# EAGLE design CHECON.PCB (EAGLE 7.5.0)
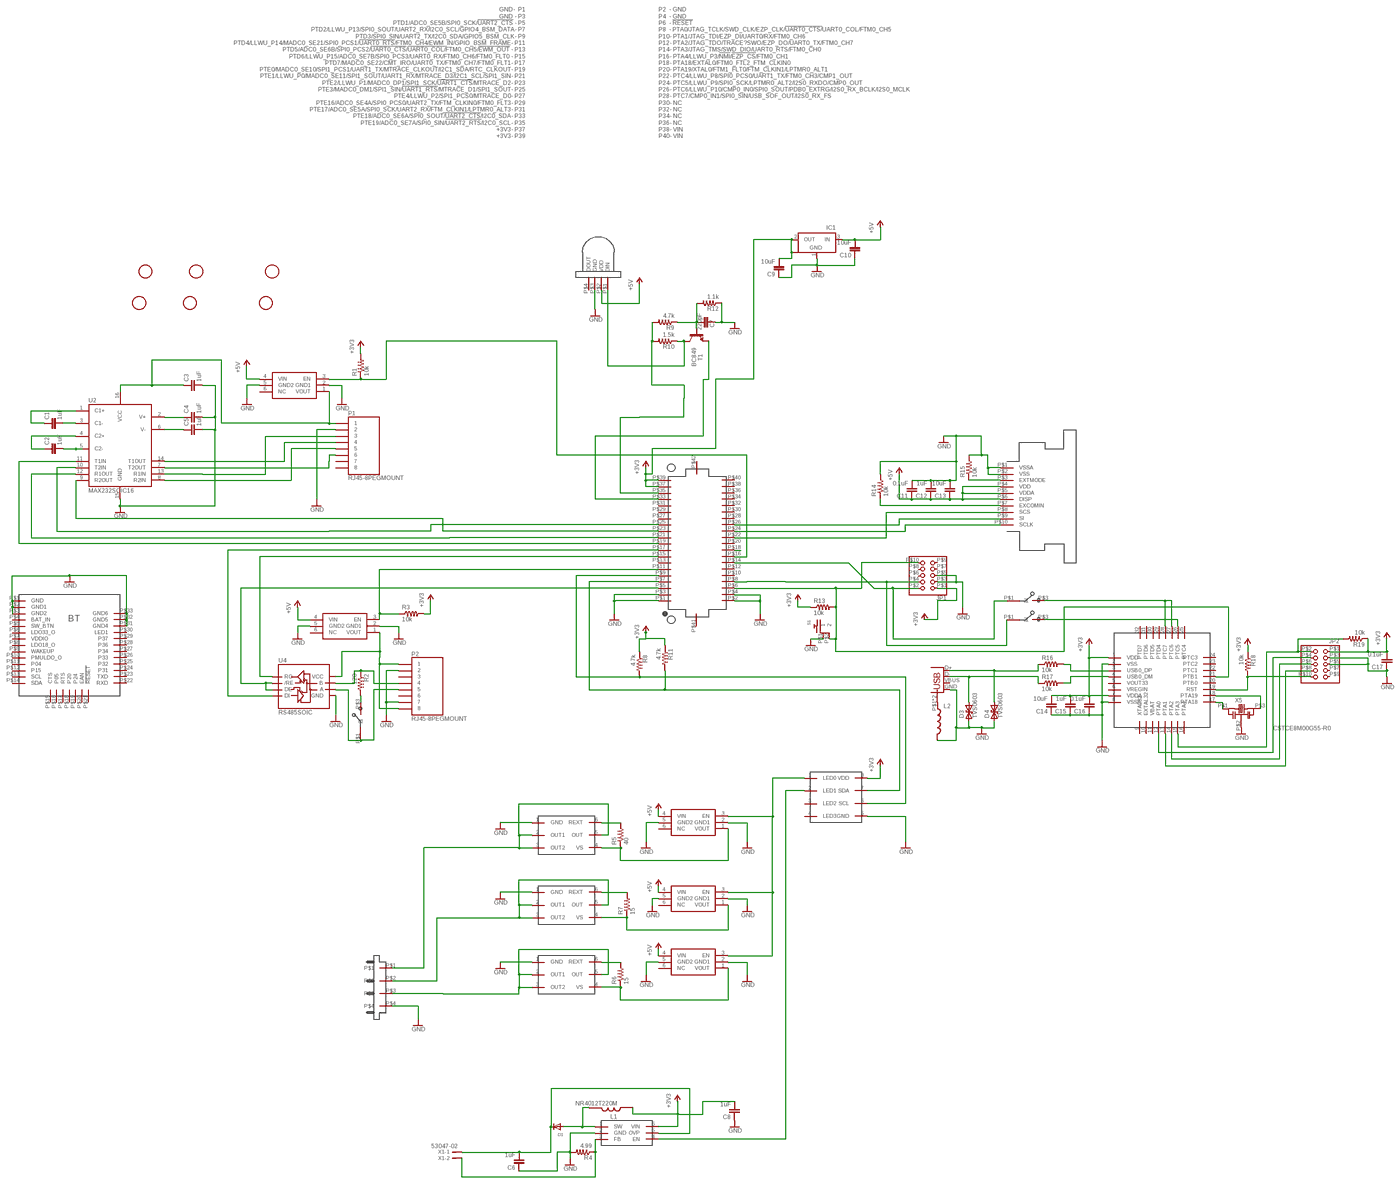
[diagram p0: schematic, sheet 1, overview]
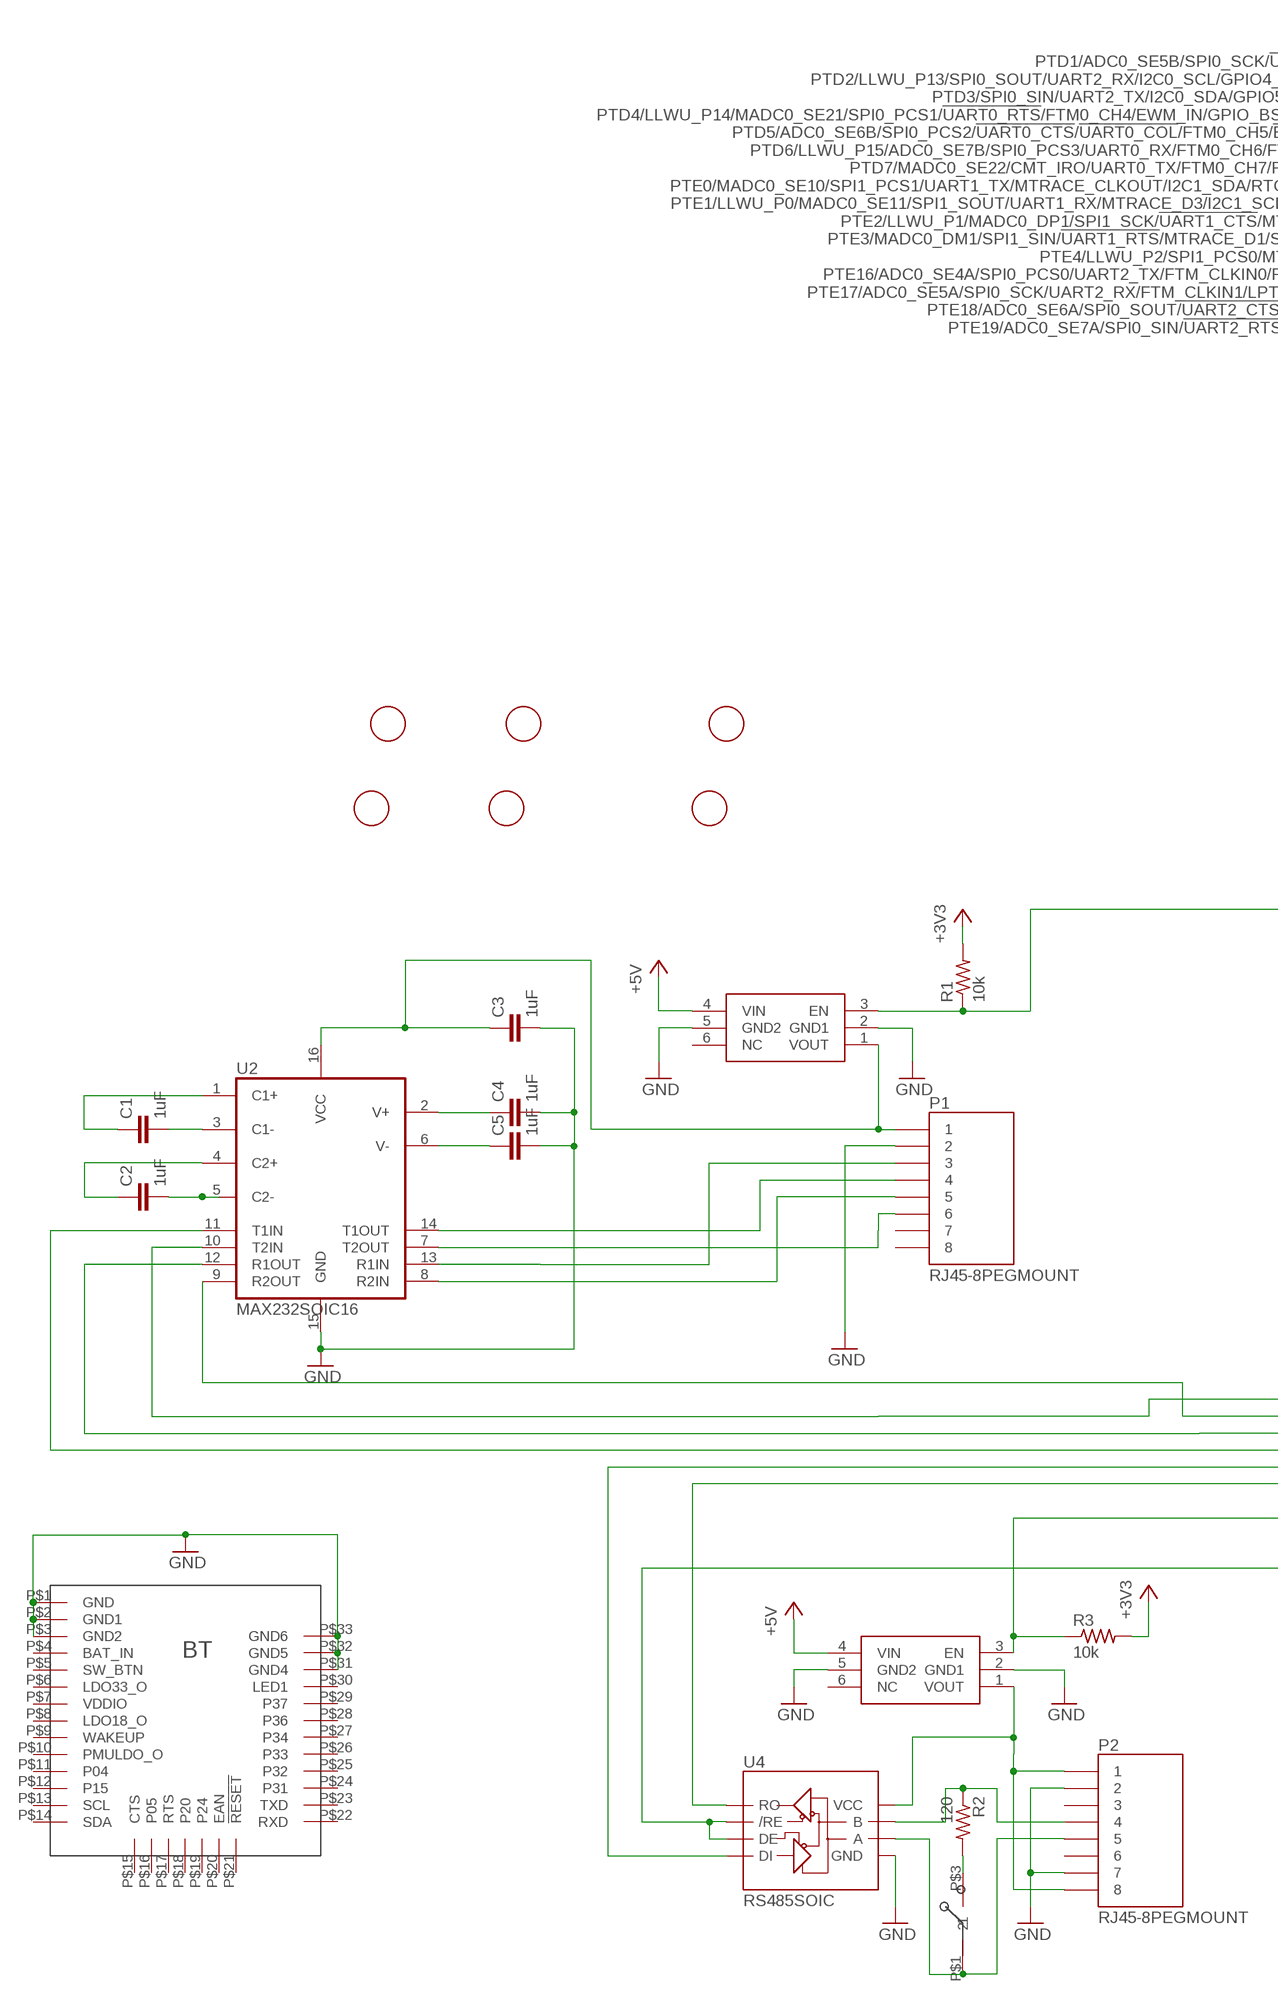
[diagram p1: schematic, sheet 1, part 1 of 4]
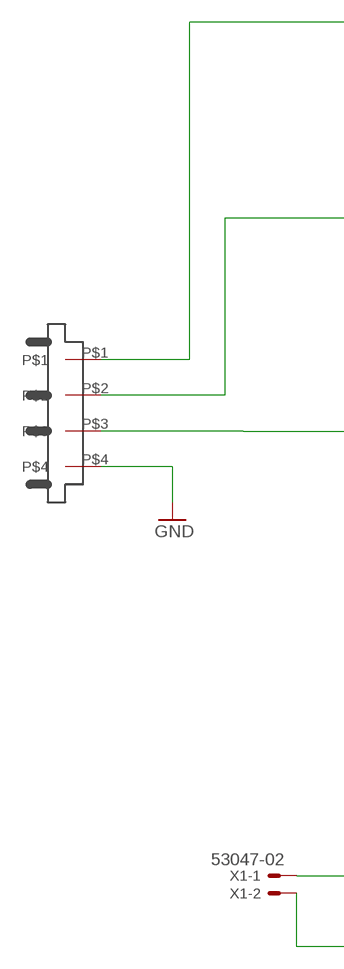
[diagram p2: schematic, sheet 1, part 2 of 4]
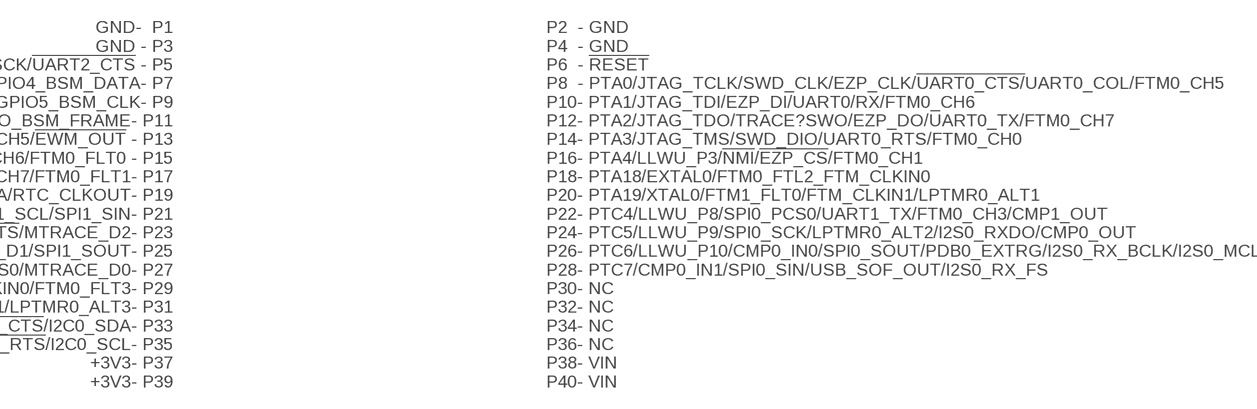
[diagram p3: schematic, sheet 1, part 3 of 4]
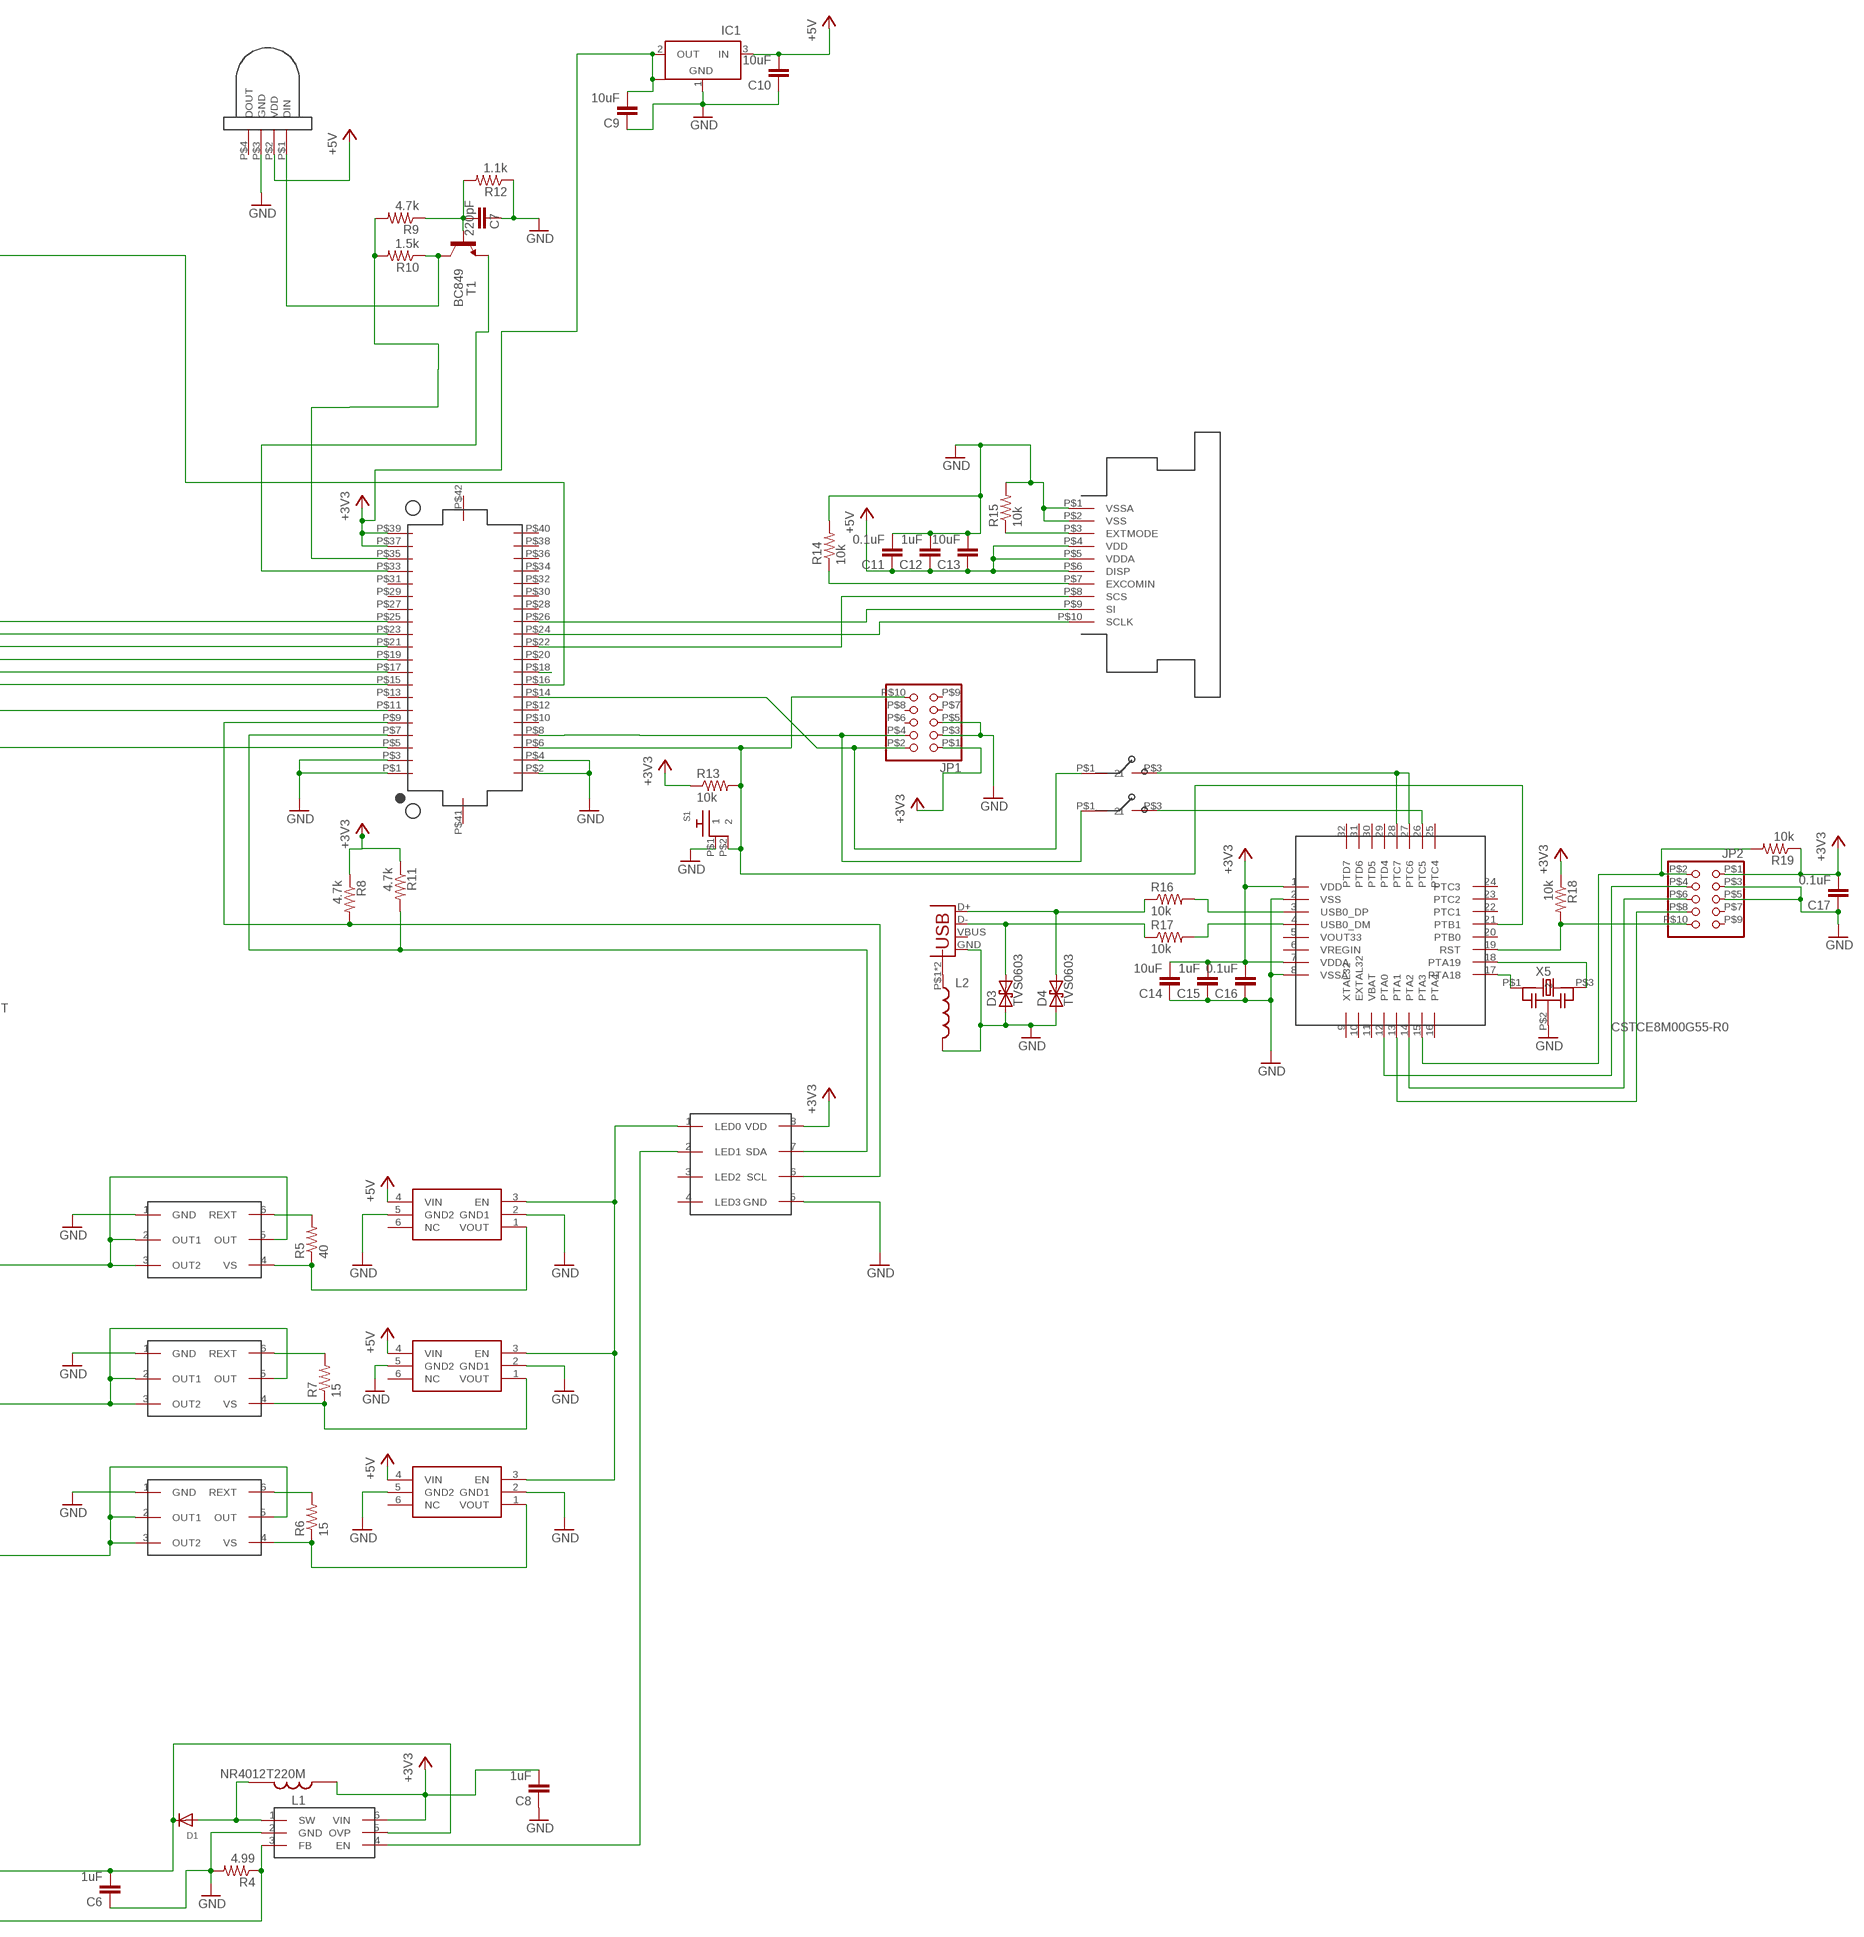
[diagram p4: schematic, sheet 1, part 4 of 4]

## Parts
C1  1uF  RF-C0805  [C0805]
C2  1uF  RF-C0805  [C0805]
C3  1uF  RF-C0805  [C0805]
C4  1uF  RF-C0805  [C0805]
C5  1uF  RF-C0805  [C0805]
C6  1uF  RF-C0805  [C0805]
C7  220pF  RF-C0805  [C0805]
C8  1uF  RF-C0805  [C0805]
C9  10uF  RF-C0805  [C0805]
C10  10uF  RF-C0805  [C0805]
C11  0.1uF  RF-C0805  [C0805]
C12  1uF  RF-C0805  [C0805]
C13  10uF  RF-C0805  [C0805]
C14  10uF  RF-C0805  [C0805]
C15  1uF  RF-C0805  [C0805]
C16  0.1uF  RF-C0805  [C0805]
C17  0.1uF  RF-C0805  [C0805]
D1  DIODESOD-523  [SOD-523]
D2  LED_PTH_2812  [LED_PTH_2812]
D3  TVS0603  [0603-RES]
D4  TVS0603  [0603-RES]
F1  FIDUCIAL  [FIDUCIAL_1MM]
F2  FIDUCIAL  [FIDUCIAL_1MM]
F3  FIDUCIAL  [FIDUCIAL_1MM]
F4  FIDUCIAL  [FIDUCIAL_1MM]
F5  FIDUCIAL  [FIDUCIAL_1MM]
F6  FIDUCIAL  [FIDUCIAL_1MM]
IC1  NCP1117ST33T3G_1  [SOT223]
J1  2.7_BL_CONN  [XD2B-0406-26A]
J2  USB_B  [USB-B-PTH-VERTICAL]
J3  52745-1097  [52745-1097]
JP1  PINHD-2X5SMALL  [2X5HDR]
JP2  PINHD-2X5SMALL  [2X5HDR]
L1  NR4012T220M  [NR4012T220M]
L2  INDUCTOR0603  [0603]
P1  RJ45-8PEGMOUNT  [MOLEX-0955016889]
P2  RJ45-8PEGMOUNT  [MOLEX-0955016889]
R1  10k  RF-R0805  [RF-C0805]
R2  120  RF-R0805  [RF-C0805]
R3  10k  RF-R0805  [RF-C0805]
R4  4.99  RF-R0805  [RF-C0805]
R5  40  RF-R0805  [RF-C0805]
R6  15  RF-R0805  [RF-C0805]
R7  15  RF-R0805  [RF-C0805]
R8  4.7k  RF-R0805  [RF-C0805]
R9  4.7k  RF-R0805  [RF-C0805]
R10  1.5k  RF-R0805  [RF-C0805]
R11  4.7k  RF-R0805  [RF-C0805]
R12  1.1k  RF-R0805  [RF-C0805]
R13  10k  RF-R0805  [RF-C0805]
R14  10k  RF-R0805  [RF-C0805]
R15  10k  RF-R0805  [RF-C0805]
R16  10k  RF-R0805  [RF-C0805]
R17  10k  RF-R0805  [RF-C0805]
R18  10k  RF-R0805  [RF-C0805]
R19  10k  RF-R0805  [RF-C0805]
S1  RA_BUTTON  [RA_BUTTON]
SW1  CJS  [CJS]
SW2  CJS  [CJS]
SW3  CJS  [CJS]
T1  BC849  [SOT23]
U1  BM78  [BM78]
U2  MAX232SOIC16  [SO016]
U3  MIC94061C6  [SC70-6L]
U4  RS485SOIC  [SO08]
U5  MIC94061C6  [SC70-6L]
U6  AP5724  [SOT23-6]
U7  MIC94061C6  [SC70-6L]
U8  MIC94061C6  [SC70-6L]
U9  MIC94061C6  [SC70-6L]
U10  KW2_CPU_OFFSET  [BRAIN_OFFSET]
U11  PCA9632DP1  [TSSOP-8]
U12  KL20  [QFN-32-NOPAD]
X1  53047-02  [53047-02]
X2  BCR401U  [SOT23-6]
X3  BCR401U  [SOT23-6]
X4  BCR401U  [SOT23-6]
X5  CSTCE8M00G55-R0  [CSTCE_G_A]

## Nets
+3V3: C8.2 C9.2 C14.2 C15.2 C16.2 C17.2 IC1.2(OUT) IC1.4(OUT1) JP1.P$1 JP2.P$1 L1.P$2 R1.2 R3.2 R8.1 R11.1 R13.1 R18.1 R19.1 U6.6(VIN) U10.P$37(+3V3) U10.P$39(+3V3) U11.8(VDD) U12.1(VDD) U12.7(VDDA)
+5V: C10.2 D2.P$2(VDD) IC1.3(IN) U7.4(VIN) U8.4(VIN) U9.4(VIN)
C1: C1.1 U2.1(C1+)
C2: C2.1 U2.4(C2+)
GND [GND]: C3.2 C4.2 C5.2 C6.1 C7.1 C8.1 C9.1 C10.1 C11.2 C12.2 C13.2 C14.1 C15.1 C16.1 C17.1 D2.P$3(GND) D3.1 D4.1 IC1.1(GND) J1.P$4 J2.GND J3.P$1(VSSA) J3.P$2(VSS) JP1.P$3 JP1.P$5 JP2.P$3 JP2.P$5 L2.2 P1.P$2 P2.P$2 P2.P$7 R4.2 R12.1 R14.2 R15.2 S1.P$1 U1.P$1(GND) U1.P$2(GND1) U1.P$3(GND2) U1.P$31(GND4) U1.P$32(GND5) U1.P$33(GND6) U2.15(GND) U3.2(GND1) U3.5(GND2) U4.5(GND) U5.2(GND1) U5.5(GND2) U6.2(GND) U7.2(GND1) U7.5(GND2) U8.2(GND1) U8.5(GND2) U9.2(GND1) U9.5(GND2) U10.P$1(GND) U10.P$2(GND) U10.P$3(GND) U10.P$4(GND) U11.5(GND) U12.2(VSS) U12.8(VSSA) X2.1(GND) X3.1(GND) X4.1(GND) X5.P$2
N$1: SW2.P$3 U12.27(PTC6) U12.28(PTC7)
N$2: U6.4(EN) U11.2(LED1)
N$3: R4.1 U6.3(FB) X1.2
N$4: U12.17(PTA18) X5.P$1
N$5: J2.P$1(SHIELD) J2.P$2(SHIELD) L2.1
N$6: U12.18(PTA19) X5.P$3
N$7: P1.P$6 U2.7(T2OUT)
N$9: J1.P$1 X2.2(OUT1) X2.3(OUT2) X2.5(OUT)
N$10: U2.12(R1OUT) U10.P$21(PTE1/LLWU_P0/MADC0_SE11/SPI1_SOUT/UART1_RX/MTRACE_D3/I2C1_SCL/SPI1_SIN)
N$11: R9.2 R10.2 U10.P$35(PTE19/ADC0_SE7A/SPI0_SIN/!UART2_RTS!/I2C0_SCL)
N$12 [GND]: P1.P$4 U2.14(T1OUT)
N$13: R6.1 U9.1(VOUT) X4.4(VS)
N$14: R7.1 U8.1(VOUT) X3.4(VS)
N$15: R5.1 U7.1(VOUT) X2.4(VS)
N$16: T1.2(E) U10.P$33(PTE18/ADC0_SE6A/SPI0_SOUT/!UART2_CTS!/I2C0_SDA)
N$17 [GND]: U4.1(RO) U10.P$15(PTD6/LLWU_P15/ADC0_SE7B/SPI0_PCS3/UART0_RX/FTM0_CH6/FTM0_FLT0)
N$18: C1.2 U2.3(C1-)
N$19: P2.P$4 R2.1 U4.7(B)
N$20: P2.P$5 SW1.P$1 U4.6(A)
N$21: C2.2 U2.5(C2-)
N$22: C5.1 U2.6(V-)
N$23: C4.1 U2.2(V+)
N$24: R16.2 U12.3(USB0_DP)
N$25: C3.1 P1.P$1 U2.16(VCC) U3.1(VOUT)
N$26: U2.11(T1IN) U10.P$19(PTE0/MADC0_SE10/SPI1_PCS1/UART1_TX/MTRACE_CLKOUT/I2C1_SDA/RTC_CLKOUT)
N$27 [GND]: U4.4(DI) U10.P$17(PTD7/MADC0_SE22/CMT_IRO/UART0_TX/FTM0_CH7/FTM0_FLT1)
N$28 [GND]: U4.2(/RE) U4.3(DE) U10.P$5(PTD1/ADC0_SE5B/SPI0_SCK/!UART2_CTS)
N$29 [GND]: J3.P$9(SI) U10.P$26(PTC6/LLWU_P10/CMP0_IN0/SPI0_SOUT/PDB0_EXTRG/I2S0_RX_BCLK/I2S0_MCLK)
N$30 [GND]: J3.P$10(SCLK) U10.P$24(PTC5/LLWU_P8/SPI0_PCS0/UART1_TX/FTM0_CH3/CMP1_OUT)
N$31 [GND]: J3.P$8(SCS) U10.P$22(PTC4/LLWU_P8/SPI0_PCS0/UART1_TX/FTM0_CH3/CMP1_OUT)
N$32 [GND]: J3.P$3(EXTMODE) R15.1
N$33 [GND]: J3.P$7(EXCOMIN) R14.1
N$34: P1.P$5 U2.8(R2IN)
N$35: D3.2 J2.D- R17.1
N$36: D4.2 J2.D+ R16.1
N$37: R6.2 X4.6(REXT)
N$38: U2.9(R2OUT) U10.P$23(PTE2/LLWU_P1/MADC0_DP1/SPI1_SCK/!UART1_CTS!/MTRACE_D2)
N$39: R3.1 U5.3(EN) U10.P$11(PTD4/LLWU_P14/MADC0_SE21/SPI0_PCS1/!UART0_RTS!/FTM0_CH4/EWM_IN/GPIO_BSM_FRAME)
N$40: R1.1 U3.3(EN) U10.P$16(PTA4/LLWU_P3/!NMI!/!EZP_CS!/FTM0_CH1)
N$41: U2.10(T2IN) U10.P$25(PTE3/MADC0_DM1/SPI1_SIN/!UART1_RTS!/MTRACE_D1/SPI1_SOUT)
N$42: R7.2 X3.6(REXT)
N$43: R5.2 X2.6(REXT)
N$44: U7.3(EN) U8.3(EN) U9.3(EN) U11.1(LED0)
N$45: R11.2 U10.P$7(PTD2/LLWU_P13/SPI0_SOUT/UART2_RX/I2C0_SCL/GPIO4_BSM_DATA) U11.7(SDA)
N$46: U10.P$18(PTA18/EXTAL0/FTM0_FTL2_FTM_CLKIN0)
N$47: R8.2 U10.P$9(PTD3/SPI0_SIN/UART2_TX/I2C0_SDA/GPIO5_BSM_CLK) U11.6(SCL)
N$48: D2.P$1(DIN) R10.1 T1.3(C)
N$49: C7.2 R9.1 R12.2 T1.1(B)
N$50: D1.A L1.P$1 U6.1(SW)
N$51: J1.P$3 X4.2(OUT1) X4.3(OUT2) X4.5(OUT)
N$52: JP2.P$2 R19.2 U12.15(PTA3)
N$53: J1.P$2 X3.2(OUT1) X3.3(OUT2) X3.5(OUT)
N$54: C6.2 D1.K(C) U6.5(OVP) X1.1
N$55: JP2.P$4 U12.12(PTA0)
N$56: JP2.P$6 U12.14(PTA2)
N$57: JP2.P$8 U12.13(PTA1)
N$58: JP2.P$10 R18.2 U12.19(RST)
N$59: R2.2 SW1.P$3
N$60: R17.2 U12.4(USB0_DM)
R1IN: P1.P$3 U2.13(R1IN)
RST: JP1.P$10 R13.2 S1.P$2 U10.P$6(!RESET) U12.21(PTB1)
SWD_CLK: JP1.P$4 SW3.P$1 U10.P$8(PTA0/JTAG_TCLK/SWD_CLK/EZP_CLK/!UART0_CTS/!UART0_COL/FTM0_CH5)
SWD_DIO: JP1.P$2 SW2.P$1 U10.P$14(PTA3/JTAG_TMS/SWD_DIO/UART0_RTS/FTM0_CH0)
SWD_TGT_CLK: SW3.P$3 U12.26(PTC5)
V+: C11.1 C12.1 C13.1 J3.P$4(VDD) J3.P$5(VDDA) J3.P$6(DISP) P2.P$1 P2.P$8 U3.4(VIN) U4.8(VCC) U5.1(VOUT) U5.4(VIN) ; supply symbol labelled +5V
Unconnected: D2.P$4(DOUT) J2.VBUS JP1.P$6 JP1.P$7 JP1.P$8 JP1.P$9 JP2.P$7 JP2.P$9 P1.P$7 P1.P$8 P2.P$3 P2.P$6 U1.P$4(BAT_IN) U1.P$5(SW_BTN) U1.P$6(LDO33_O) U1.P$7(VDDIO) U1.P$8(LDO18_O) U1.P$9(WAKEUP) U1.P$10(PMULDO_O) U1.P$11(P04) U1.P$12(P15) U1.P$13(SCL) U1.P$14(SDA) U1.P$15(CTS) U1.P$16(P05) U1.P$17(RTS) U1.P$18(P20) U1.P$19(P24) U1.P$20(EAN) U1.P$21(!RESET) U1.P$22(RXD) U1.P$23(TXD) U1.P$24(P31) U1.P$25(P32) U1.P$26(P33) U1.P$27(P34) U1.P$28(P36) U1.P$29(P37) U1.P$30(LED1) U3.6(NC) U5.6(NC) U7.6(NC) U8.6(NC) U9.6(NC) U10.P$10(PTA1/JTAG_TDI/EZP_DI/UART0/RX/FTM0_CH6) U10.P$12(PTA2/JTAG_TDO/TRACE?SWO/EZP_DO/UART0_TX/FTM0_CH7) U10.P$13(PTD5/ADC0_SE6B/SPI0_PCS2/!UART0_CTS!/!UART0_COL!/FTM0_CH5/!EWM_OUT) U10.P$20(PTA19/XTAL0/FTM1_FLT0/FTM_CLKIN1/LPTMR0_ALT1) U10.P$27(PTE4/LLWU_P2/SPI1_PCS0/MTRACE_D0) U10.P$28(PTC7/CMP0_IN1/SPI0_SIN/USB_SOF_OUT/I2S0_RX_FS) U10.P$29(PTE16/ADC0_SE4A/SPI0_PCS0/UART2_TX/FTM_CLKIN0/FTM0_FLT3) U10.P$30(NC) U10.P$31(PTE17/ADC0_SE5A/SPI0_SCK/UART2_RX/FTM_CLKIN1/LPTMR0_ALT3) U10.P$32(NC) U10.P$34(NC) U10.P$36(NC) U10.P$38(VIN) U10.P$40(VIN) U10.P$41 U10.P$42 U11.3(LED2) U11.4(LED3) U12.5(VOUT33) U12.6(VREGIN) U12.9(XTAL32) U12.10(EXTAL32) U12.11(VBAT) U12.16(PTA4) U12.20(PTB0) U12.22(PTC1) U12.23(PTC2) U12.24(PTC3) U12.25(PTC4) U12.29(PTD4) U12.30(PTD5) U12.31(PTD6) U12.32(PTD7)

## Library data of the parts
C1-C6 C8 C12 C15 = GW-devices:RF-C: RF capacitor pads for FSL reference design; MFGN: TDK; MFGP: C2012X5R1E105K125AA
C7 C11 C16 C17 = GW-devices:RF-C: RF capacitor pads for FSL reference design; MFGN: TDK; MFGP: C2012X5R1H104K085AA
C9 C10 C13 C14 = GW-devices:RF-C: RF capacitor pads for FSL reference design; MFGN: Murata; MFGP: GRM219R61E106KA12D
D1 = adafruit:DIODE: Diode SMADIODE - SMA Surface Mount Package 20V 1A Schottky Diode Digikey: 641-1014-6-ND DO-1N4148 - Through Hole Small Current Diode SOD-123 20V 1 A (.5mV Vf) Schottky Diode - Digikey: MBRX120TPMSCT-ND SOD-323 10V 570mA (.38mV Vf, 3ns) Schottky Diode - Digikey: ZLLS410CT-ND SOD-523 30V 30mA Schottky Diode (RB751S-40TE61) - Digikey: RB751S-40TE61CT-ND SOT23-R/W - SOT23 Package (R = Solder Paste/Reflow Ovens, W = Hand-Soldering) BAT54Film 40V 300mA - Digikey: 497-7162-1-ND; MFGN: Diodes, Inc.; MFGP: SDM20U40-7
D2 = KW2:LED_PTH_2812; MFGN: Sparkfun; MFGP: COM-12999
D3 D4 = SparkFun:TVS; MFGN: Eaton Bussman; MFGP: 0603ESDA2-TR2
F1-F6 = adafruit:FIDUCIAL: For use by pick and place machines to calibrate the vision/machine, 1mm By microbuilder.eu; NOTES: DNP
IC1 = KW2:NCP1117ST33T3G_1: VOLTAGE REGULATOR; MFGN: OnSemi; MFGP: NCP1117ST33T3G
J1 = KW2:2.7_BL_CONN; MFGN: Omron Electronics; MFGP: XD2B-0406-26A
J2 = KW2:USB_B; MFGN: Harwin; MFGP: M701-330442
J3 = KW2:52745-1097
JP1 JP2 = KW2:PINHD-2X5: PIN HEADER; MFGN: Sullins Connector Solutions; MFGP: GRPB052VWVN-RC
L1 = KW2:NR4012T220M; MFGN: Taiyo Yuden; MFGP: NR4012T220M
L2 = SparkFun:INDUCTOR: Inductors Basic Inductor/Choke - 0603 and 1206. Footprints are not proven and vary greatly between part numbers.; MFGN: TDK; MFGP: MPZ1608S331ATA00
P1 P2 = GW-devices:RJ45-8: RJ45 Jack MFG part number 54602-908lf
R1-R3 R8 R11 = GW-devices:RF-R: RF resistor pads for FSL reference design; MFGN: Panasonic; MFGP: ERJ-6ENF4701V
R4 = GW-devices:RF-R: RF resistor pads for FSL reference design; MFGN: Stackpole Electronics Inc.; MFGP: RMCF0805FT4R99
R5 = GW-devices:RF-R: RF resistor pads for FSL reference design; MFGN: Yageo; MFGP: RC0805FR-0740R2L
R6 R7 = GW-devices:RF-R: RF resistor pads for FSL reference design; MFGN: Yageo; MFGP: RC0805FR-0715RL
R9 R10 R12-R19 = GW-devices:RF-R: RF resistor pads for FSL reference design; MFGN: Vishay Dale; MFGP: CRCW080510K0FKEA
S1 = KW2:RA_BUTTON
SW1-SW3 = KW2:CJS; MFGN: Copal Electronics Inc; MFGP: CJS-1200TA
T1 = transistor:BC849: NPN TRANSISTOR
U1 = KW2:BM78
U2 = SparkFun:MAX232: RS232 Transceiver Very common IC. This is generically called 'MAX232', but works with the 3V equivalent MAX3232 generic ICs. Field tested and mother approved. Spark Fun Electronics SKU : COM-00316 (DIP) and COM-00589 (SMD); PRICE: 0.86
U3 U5 U7-U9 = GW-devices:MIC94061; MFGN: Micrel; MFGP: MIC94061YC6 TR; PRICE: 1.50
U4 = SparkFun:RS485; PRICE: 4.29
U6 = KW2:AP5724; MFGN: Diodes, Inc; MFGP: AP5724
U10 = KW2:KW2_CPU
U11 = KW2:PCA9632DP1; MFGN: NXP; MFGP: PCA9632DP1
U12 = KW2:KL20; MFGN: Freescale; MFGP: MK20DX128VFM5
X1 = con-molex:53?-02: CONNECTOR wire to board 1.25 mm (.049 inch) pitch header; MF: MOLEX; MPN: 53047-0210; OC_FARNELL: 9733051; OC_NEWARK: 57H4701
X2-X4 = KW2:BCR401U; MFGN: Infineon; MFGP: BCR401U
X5 = KW2:CSTCE8M00G55-R0

## Board
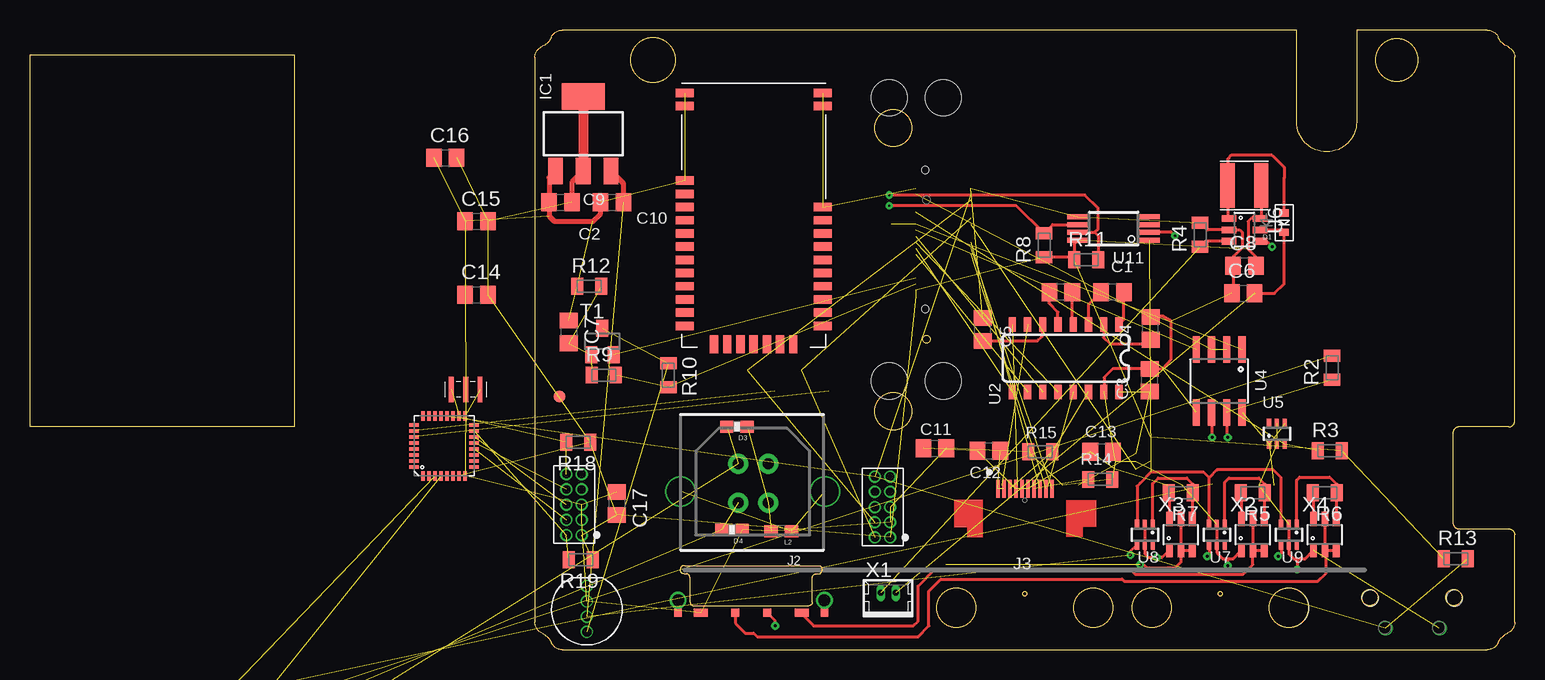
[diagram p5: board, top side]
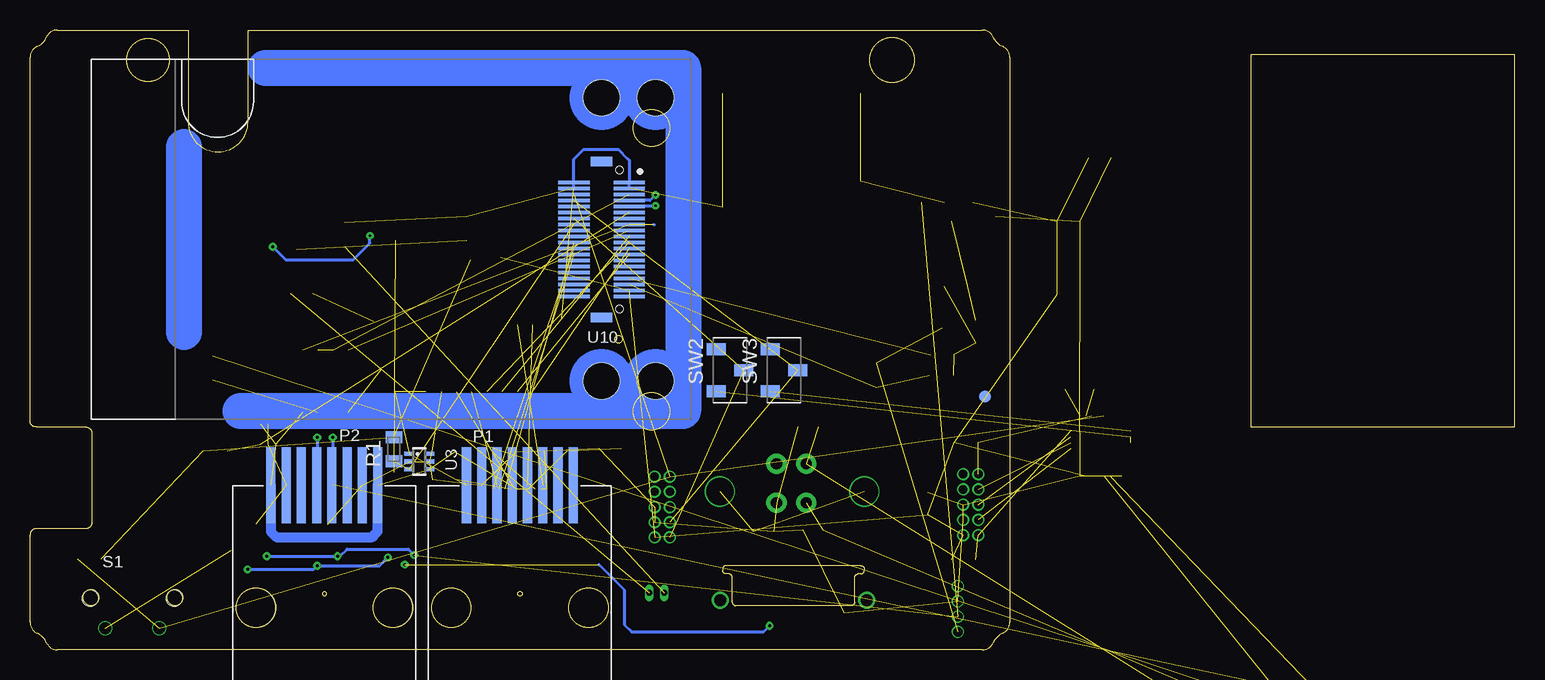
[diagram p6: board, bottom side, seen from below]

Size 123.73 x 51.65 mm. Coordinates in mm from the lower left corner, seen from the top.
Outline: 60 segments
Outline: circle at 51.9,49.16 radius 1.85
Outline: circle at 71.93,43.48 radius 1.52
Outline: circle at 113.9,49.16 radius 1.75
Outline: circle at 118.65,4.36 radius 0.65
Outline: circle at 111.64,4.36 radius 0.65
Outline: circle at 104.9,3.5 radius 1.62
Outline: circle at 93.47,3.5 radius 1.62
Outline: circle at 88.62,3.5 radius 1.62
Outline: circle at 77.19,3.5 radius 1.62
Outline: circle at 71.93,19.88 radius 1.52
Outline: circle at 74.7,25.88 radius 0.3
Outline: circle at 71.93,43.48 radius 1.52
Outline: circle at 71.93,19.88 radius 1.52
Outline: circle at 74.7,25.88 radius 0.3
Outline: circle at 113.9,49.16 radius 1.75
Outline: circle at 51.9,49.16 radius 1.85
Outline: circle at 82.9,4.67 radius 0.17
Outline: circle at 99.19,4.67 radius 0.14
Outline: circle at 104.9,3.5 radius 1.62
Outline: circle at 93.47,3.5 radius 1.62
Copper layers (1*16): Top 0.035559375mm / dielectric 1.47mm / Bottom 0.035559375mm
Design rules "Codeshelf_Advanced *": minimum track width 0.2mm, minimum drill 0.25mm, track to track 0.2mm, track to pad 0.2mm, pad to pad 0.2mm, via to via 0.2mm, smd to smd 0mil, copper to edge 0.2mm, drill to drill 0.2mm, minimum pad ring 0.1mm, minimum via ring 0.2mm, stop-mask expansion 0.05mm, vias tented up to drill 0.5mm, thermal gap 0.25mm
Holes 2.5 mm at 50.6,57

### Footprints (pad centres in the part's own frame; a part is rotated, then mirrored left to right if it is on the bottom)
C0805 = smd 1.3 x 1.5: 1 -0.95,0; 2 0.95,0
SOD-523 = smd 0.8 x 0.6: A 0,-0.8; K 0,0.8
LED_PTH_2812 = drill 0.8 pad 1.016: P$1 0,-1.905; P$2 0,-0.635; P$3 0,0.635; P$4 0,1.905
0603-RES = smd 1.1 x 1: 1 -0.85,0; 2 0.85,0
FIDUCIAL_1MM = smd 1 x 1: 1 0,0
SOT223 = smd 1.219 x 2.235: 1 -2.311,-3.099; 2 0,-3.099; 3 2.311,-3.099 | smd 3.6 x 2.2: 4 0,3.099
XD2B-0406-26A = smd 1.15 x 0.65: P$1 4.2,0; P$4 -4.2,0 | smd 0.65 x 0.65: P$2 1.325,0; P$3 -1.325,0; P$7 -6.1,0; P$8 6.1,0 | drill 1 pad 1.4: P$5 -6.1,1.025; P$6 6.1,1.025
USB-B-PTH-VERTICAL = drill 0.92 pad 1.676: D+ 4.826,3.95; D- 4.826,7.2; GND 7.315,3.95; VBUS 7.315,7.2 | drill 2.3: P$1 0,4.9; P$2 12.04,4.9
52745-1097 = smd 0.3 x 1.5: P$1 -2.25,0.95; P$2 -1.75,0.95; P$3 -1.25,0.95; P$4 -0.75,0.95; P$5 -0.25,0.95; P$6 0.25,0.95; P$7 0.75,0.95; P$8 1.25,0.95; P$9 1.75,0.95; P$10 2.25,0.95
2X5HDR = drill 0.7 pad 1: P$1 -2.54,-0.67; P$2 -2.54,0.6; P$3 -1.27,-0.67; P$4 -1.27,0.6; P$5 0,-0.67; P$6 0,0.6; P$7 1.27,-0.67; P$8 1.27,0.6; P$9 2.54,-0.67; P$10 2.54,0.6
NR4012T220M = smd 1.2 x 3.7: P$1 1.4,0; P$2 -1.4,0
0603 = smd 1.1 x 1: 1 -0.85,0; 2 0.85,0
MOLEX-0955016889 = smd 0.76 x 6.35: P$1 -4.45,10.225; P$2 -3.18,10.225; P$3 -1.91,10.225; P$4 -0.64,10.225; P$5 0.63,10.225; P$6 1.905,10.225; P$7 3.175,10.225; P$8 4.445,10.225 | hole 3.25: -5.715,0; 5.715,0
RF-C0805 = smd 1 x 1.4: 1 -1,0; 2 1,0
RA_BUTTON = drill 0.99: P$1 -2.25,0; P$2 2.25,0 | hole 1.3: -3.501,2.49; 3.501,2.49
CJS = smd 1 x 1.6: P$1 0,1.15; P$2 -1.75,-1.15; P$3 1.75,-1.15
SOT23 = smd 1 x 1.4: 1 -0.95,-1.1; 2 0.95,-1.1; 3 0,1.1
BM78 = smd 1.5 x 0.7: P$1 -5.75,21.2; P$2 -5.75,20.1; P$3 -5.75,13.9; P$4 -5.75,12.8; P$5 -5.75,11.7; P$6 -5.75,10.6; P$7 -5.75,9.5; P$8 -5.75,8.4; P$9 -5.75,7.3; P$10 -5.75,6.2; P$11 -5.75,5.1; P$12 -5.75,4; P$13 -5.75,2.9; P$14 -5.75,1.8; P$22 5.75,1.8; P$23 5.75,2.9; P$24 5.75,4; P$25 5.75,5.1; P$26 5.75,6.2; P$27 5.75,7.3; P$28 5.75,8.4; P$29 5.75,9.5; P$30 5.75,10.6; P$31 5.75,11.7; P$32 5.75,20.1; P$33 5.75,21.2 | smd 0.7 x 1.5: P$15 -3.3,0.25; P$16 -2.2,0.25; P$17 -1.1,0.25; P$18 0,0.25; P$19 1.1,0.25; P$20 2.2,0.25; P$21 3.3,0.25
SO016 = smd 0.6 x 1.2: 1 -4.445,-2.8; 2 -3.175,-2.8; 3 -1.905,-2.8; 4 -0.635,-2.8; 5 0.635,-2.8; 6 1.905,-2.8; 7 3.175,-2.8; 8 4.445,-2.8; 9 4.445,2.8; 10 3.175,2.8; 11 1.905,2.8; 12 0.635,2.8; 13 -0.635,2.8; 14 -1.905,2.8; 15 -3.175,2.8; 16 -4.445,2.8
SC70-6L = smd 0.35 x 0.8: 1 -0.65,-0.85; 2 0,-0.85; 3 0.65,-0.85; 4 0.65,0.85; 5 0,0.85; 6 -0.65,0.85
SO08 = smd 0.61 x 2.21: 1 -1.905,-2.616; 2 -0.635,-2.616; 3 0.635,-2.616; 4 1.905,-2.616; 5 1.905,2.616; 6 0.635,2.616; 7 -0.635,2.616; 8 -1.905,2.616
SOT23-6 = smd 0.55 x 1.2: 1 -0.95,-1.3; 2 0,-1.3; 3 0.95,-1.3; 4 0.95,1.3; 5 0,1.3; 6 -0.95,1.3
BRAIN_OFFSET = smd 0.3 x 2.6: P$1 -4.75,2.3; P$2 -4.75,-2.3; P$3 -4.25,2.3; P$4 -4.25,-2.3; P$5 -3.75,2.3; P$6 -3.75,-2.3; P$7 -3.25,2.3; P$8 -3.25,-2.3; P$9 -2.75,2.3; P$10 -2.75,-2.3; P$11 -2.25,2.3; P$12 -2.25,-2.3; P$13 -1.75,2.3; P$14 -1.75,-2.3; P$15 -1.25,2.3; P$16 -1.25,-2.3; P$17 -0.75,2.3; P$18 -0.75,-2.3; P$19 -0.25,2.3; P$20 -0.25,-2.3; P$21 0.25,2.3; P$22 0.25,-2.3; P$23 0.75,2.3; P$24 0.75,-2.3; P$25 1.25,2.3; P$26 1.25,-2.3; P$27 1.75,2.3; P$28 1.75,-2.3; P$29 2.25,2.3; P$30 2.25,-2.3; P$31 2.75,2.3; P$32 2.75,-2.3; P$33 3.25,2.3; P$34 3.25,-2.3; P$35 3.75,2.3; P$36 3.75,-2.3; P$37 4.25,2.3; P$38 4.25,-2.3; P$39 4.75,2.3; P$40 4.75,-2.3 | smd 0.8 x 1.8: P$41 -6.5,0; P$42 6.5,0 | hole 0.6: -5.8,1.5; 5.8,1.5 | hole 3: -11.8,4.5; 11.8,4.5; -11.8,0; 11.8,0
TSSOP-8 = smd 0.42 x 1.78: 1 -0.975,-2.975; 2 -0.325,-2.975; 3 0.325,-2.975; 4 0.975,-2.975; 5 0.975,2.975; 6 0.325,2.975; 7 -0.325,2.975; 8 -0.975,2.975
QFN-32-NOPAD = smd 0.8 x 0.285: 1 -2.5,1.75; 2 -2.5,1.25; 3 -2.5,0.75; 4 -2.5,0.25; 5 -2.5,-0.25; 6 -2.5,-0.75; 7 -2.5,-1.25; 8 -2.5,-1.75; 17 2.5,-1.75; 18 2.5,-1.25; 19 2.5,-0.75; 20 2.5,-0.25; 21 2.5,0.25; 22 2.5,0.75; 23 2.5,1.25; 24 2.5,1.75 | smd 0.285 x 0.8: 9 -1.75,-2.5; 10 -1.25,-2.5; 11 -0.75,-2.5; 12 -0.25,-2.5; 13 0.25,-2.5; 14 0.75,-2.5; 15 1.25,-2.5; 16 1.75,-2.5; 25 1.75,2.5; 26 1.25,2.5; 27 0.75,2.5; 28 0.25,2.5; 29 -0.25,2.5; 30 -0.75,2.5; 31 -1.25,2.5; 32 -1.75,2.5
53047-02 = drill 0.5 pad 0.698 long: 1 0.625,0.45; 2 -0.625,0.45
CSTCE_G_A = smd 0.4 x 2.1: P$1 -1.2,0; P$2 0,0; P$3 1.2,0

### Placement (x,y rotation side)
C1  90.2,29.8 180 top
C2  85.9,29.8 180 top
C3  93.33,22.47 90 top
C4  93.38,26.79 90 top
C5  79.4,26.7 90 top
C6  101.1,29.7 0 top
C7  44.9,26.5 270 top
C8  101.2,32 0 top
C9  44.2,37.3 0 top
C10  48.5,37.3 0 top
C11  75.4,16.8 0 top
C12  79.9,16.6 0 top
C13  89.3,16.5 0 top
C14  37.2,29.6 0 top
C15  37.2,35.7 0 top
C16  34.6,41 0 top
C17  48.9,12.2 270 top
D1  104.5,35.6 180 top
D2  46.4,3.4 0 top
D3  58.9,18.6 180 top
D4  58.5,10 180 top
F1  120.54,67.22 0 bottom  (outside the outline)
F2  44.14,21.11 0 top
F3  44.14,21.11 0 bottom
F4  44.6,67.65 0 top  (outside the outline)
F5  44.6,67.65 0 bottom  (outside the outline)
F6  120.54,67.22 0 top  (outside the outline)
IC1  46.1,43 0 top
J1  60.1,3.1 0 top
J2  54.2,8.3 0 top
J3  82.9,12.47 0 top
JP1  71,11.9 90 top
JP2  45.3,12.1 90 top
L1  101.2,38.7 180 top
L2  62.6,9.9 180 top
P1  82.9,3.5 0 bottom
P2  99.2,3.5 0 bottom
R1  93.4,16.7 90 bottom
R2  108.5,23.5 90 top
R3  108.3,16.6 0 top
R4  97.5,34.6 90 top
R5  101.9,13.1 180 top
R6  107.9,13.1 180 top
R7  95.9,13.1 180 top
R8  84.5,33.7 90 top
R9  47.8,22.9 0 top
R10  53.2,22.9 270 top
R11  88,32.5 0 top
R12  46.6,30.3 0 top
R13  118.8,7.6 0 top
R14  89.2,14.2 0 top
R15  84.2,16.5 180 top
R16  7.8,-11.5 0 top  (outside the outline)
R17  7.8,-17.1 0 top  (outside the outline)
R18  45.7,17.3 180 top
R19  45.9,7.5 180 top
S1  115.2,1.8 0 bottom
SW1  8.6,-6.6 0 top  (outside the outline)
SW2  65.4,23.3 270 bottom
SW3  60.9,23.3 270 bottom
T1  47.7,25.7 0 top
U1  60.3,25.2 0 top
U2  86.3,24.3 180 top
U3  91.29,15.69 270 bottom
U4  99.1,22.4 180 top
U5  103.9,18 0 top
U6  101.2,35 270 top
U7  98.9,9.6 180 top
U8  92.9,9.6 180 top
U9  104.9,9.6 180 top
U10  76.1,34.2 270 bottom
U11  90.3,35.1 90 top
U12  34.5,17 90 top
X1  71.5,4.3 0 top
X2  101.9,9.6 0 top
X3  95.9,9.6 0 top
X4  107.9,9.6 0 top
X5  36.3,21.7 180 top

### Tracks (layer width: path | path; a pad name or v marks a point on that pad's centre or on a via)
+3V3  (17 unrouted)
  Top 0.254: L1.P$2 102.6,36.05 U6.6 101.75,35.95 101.5,35.7 101.5,33.4 102.1,32.8 102.1,32.05 C8.2 | U11.8 87,33.8 R11.1 86.8,32.7 R8.1
  Top 0.406: IC1.2 45.15,38.95 C9.2
  Top 0.813: IC1.4 IC1.2
+5V  (via drill 0.25)  (2 unrouted)
  Top 0.254: U7.4 98.25,7.95 v98.1,7.8 | v91.7,7.9 91.7,8.2 U8.4 | U9.4 104.25,8.05 v104,7.8
  Top 0.406: IC1.3 49.45,38.86 C10.2
  Bottom 0.254: 91.8,7.8 v91.7,7.9 92.2,8.4 97.3,8.4 97.9,7.8 v98.1,7.8 v104,7.8
C1
  Top 0.254: U2.1 91.15,27.5 C1.1
C2
  Top 0.254: U2.4 86.85,27.18 C2.1
GND  (via drill 0.25)  (47 unrouted)
  Top 0.254: R4.2 98.1,35 U6.2 100.8,35 101,34.8 101,33.5 100.3,32.8 100.3,32.05 C8.1 100.25,29.8 C6.1 | U8.2 U8.5 92.9,8 93.2,7.7 v93.9,7.7 | U7.2 U7.5 98.9,8.1 99.4,7.6 99.9,7.6 | U9.2 U9.5 104.9,8 105.3,7.6 105.6,7.6 | v93.9,7.7 94.35,7.7 | 94.35,7.7 X3.1 | 99.9,7.6 100.25,7.6 X2.1 | 105.6,7.6 106.25,7.6 X4.1 | 105.6,7.6 v105.6,6.7 | v99.8,7 99.8,7.5 99.9,7.6 | 94.35,7.7 v93.9,7.7 | U2.15 89.5,21.52 89.5,22.7 90.22,23.42 C3.2 94.42,23.42 95.1,24.2 95.1,27.4 94.4,27.8 93.44,27.8 C4.2
  Top 0.406: IC1.1 43.25,39.36 C9.1 43.25,36.15 43.7,35.7 46.9,35.7 47.5,36.3 47.55,36.35 C10.1
  Bottom 0.254: v105.6,6.7 100.1,6.7 v99.8,7 94.6,7 v93.9,7.7 | U10.P$3 U10.P$1 73.8,40.8 73.9,40.9 74.7,41.7 77.6,41.7 78.4,40.9 U10.P$2 U10.P$4
N$1  (2 unrouted)
N$2  (via drill 0.2, 0.25)
  Top 0.254: U6.4 103.05,34.05 v103.5,33.6 | v95.4,34.5 95.12,34.78 U11.2
  Bottom 0.254: v103.5,33.6 102.4,32.5 96.8,32.5 95.4,33.9 v95.4,34.5
N$3  (1 unrouted)
  Top 0.254: U6.3 97.95,34.05 R4.1
N$4  (1 unrouted)
N$5  (2 unrouted)
N$6  (1 unrouted)
N$7  (1 unrouted)
N$9
  Top 0.254: X2.5 X2.2 | X2.2 X2.3 | J1.P$1 64.3,3 65.3,2 73.6,2 74,2.4 74,5.3 75.4,6.7 91.7,6.7 92.1,6.3 101.1,6.3 101.9,7.1 X2.2
N$10  (1 unrouted)
N$11  (2 unrouted)
N$12  (1 unrouted)
N$13
  Top 0.254: X4.4 108.85,13.05 R6.1 108.9,13.8 108.7,14 108.3,14.4 105.8,14.4 105.55,14.15 U9.1
N$14
  Top 0.254: X3.4 96.85,13.05 R7.1 96.9,13.8 96.8,13.9 96.4,14.3 94,14.3 93.55,13.85 U8.1
N$15
  Top 0.254: X2.4 102.85,13.05 R5.1 102.9,13.8 102.8,13.9 102.4,14.3 99.9,14.3 99.55,13.95 U7.1
N$16  (1 unrouted)
N$17  (2 unrouted)
  Bottom 0.254: 71.75,35.45 71.7,35.4
N$18
  Top 0.254: C1.2 88.21,28.76 U2.3
N$19  (via drill 0.25)  (1 unrouted)
  Top 0.254: U4.7 99.74,17.77 v99.8,17.7
  Bottom 0.254: v99.8,17.7 99.8,13.77 P2.P$4
N$20  (via drill 0.25)  (1 unrouted)
  Top 0.254: U4.6 98.47,17.73 v98.5,17.7
  Bottom 0.254: v98.5,17.7 98.5,13.8 P2.P$5
N$21
  Top 0.254: U2.5 85.67,28.13 85,28.8 84.95,28.85 C2.2
N$22
  Top 0.254: C5.1 83.95,25.75 84.3,26.1 84.4,26.2 U2.6
N$23
  Top 0.254: U2.2 89.48,26.02 90,25.5 93.04,25.5 C4.1
N$24  (1 unrouted)
N$25  (3 unrouted)
N$26  (1 unrouted)
N$27  (1 unrouted)
N$28  (2 unrouted)
N$29  (1 unrouted)
N$30  (1 unrouted)
N$31  (1 unrouted)
N$32  (1 unrouted)
N$33  (1 unrouted)
N$34  (1 unrouted)
N$35  (2 unrouted)
N$36  (2 unrouted)
N$37
  Top 0.254: R6.2 106.95,13.05 X4.6
N$38  (1 unrouted)
N$39  (2 unrouted)
N$40  (2 unrouted)
N$41  (1 unrouted)
N$42
  Top 0.254: R7.2 94.95,13.05 X3.6
N$43
  Top 0.254: R5.2 100.95,13.05 X2.6
N$44  (1 unrouted)
  Top 0.254: U7.3 98.25,14.35 | 98.25,14.35 97.8,14.8 93.4,14.8 92.5,13.9 92.25,13.65 U8.3 | U9.3 104.25,14.35 103.6,15 98.9,15 98.25,14.35
N$45  (via drill 0.2)
  Top 0.254: U11.7 88.72,34.78 | 88.72,34.78 89,34.5 R11.2 | 88.72,34.78 89,35.05 89,36.8 87.9,37.9 v71.6,37.9
  Bottom 0.254: v71.6,37.9 72.05,37.45 U10.P$7
N$47  (via drill 0.2)
  Top 0.254: U11.6 85.23,35.43 R8.2 82.2,37 v71.6,37
  Bottom 0.254: v71.6,37 71.65,36.95 U10.P$9
N$48  (2 unrouted)
N$49  (3 unrouted)
N$50
  Top 0.254: U6.1 99.8,36.05 L1.P$1 99.8,40.9 100.1,41.2 103.5,41.2 104.5,40.2 104.5,39.3 D1.A
N$51
  Top 0.254: X4.5 X4.2 | X4.2 X4.3 | J1.P$3 58.78,2.23 59.6,1.4 60.3,1.4 60.6,1.1 74,1.1 74.9,2 74.9,4.9 75.9,5.9 91,5.9 91.2,5.7 107.3,5.7 108,6.4 108,8.2 X4.2
N$52  (2 unrouted)
N$53  (via drill 0.25)  (1 unrouted)
  Top 0.254: X3.5 X3.2 | X3.2 X3.3 | v62.1,2 62.1,2.42 J1.P$2 | X3.2 95.9,7.3 95.4,6.8 93.1,6.8 92.8,7.1 v92.5,7.1
  Bottom 0.254: 76.3,7.1 74.2,5 74.2,2.1 73.6,1.5 62.6,1.5 v62.1,2
N$54  (1 unrouted)
  Top 0.254: U6.5 104.3,35 | 104.3,35 104.6,35 | C6.2 103.7,29.7 104.5,30.5 104.5,34.9 | 104.5,34.9 D1.K | 104.5,34.9 104.4,35 104.3,35
N$55  (1 unrouted)
N$56  (1 unrouted)
N$57  (1 unrouted)
N$58  (2 unrouted)
N$59  (1 unrouted)
N$60  (1 unrouted)
R1IN  (1 unrouted)
RST  (4 unrouted)
SWD_CLK  (2 unrouted)
SWD_DIO  (2 unrouted)
SWD_TGT_CLK  (1 unrouted)
V+  (10 unrouted)
  Bottom 0.813: P2.P$1 103.65,9.85 103.2,9.4 95.2,9.4 94.9,9.7 94.76,9.84 P2.P$8

### Text on the board
tPlace: CHECON.PCB.v2.0P1 | R.S 11/24/15